# EAGLE board DRI-21700-compactpcb-12s4p-v2 (EAGLE 9.6.1)
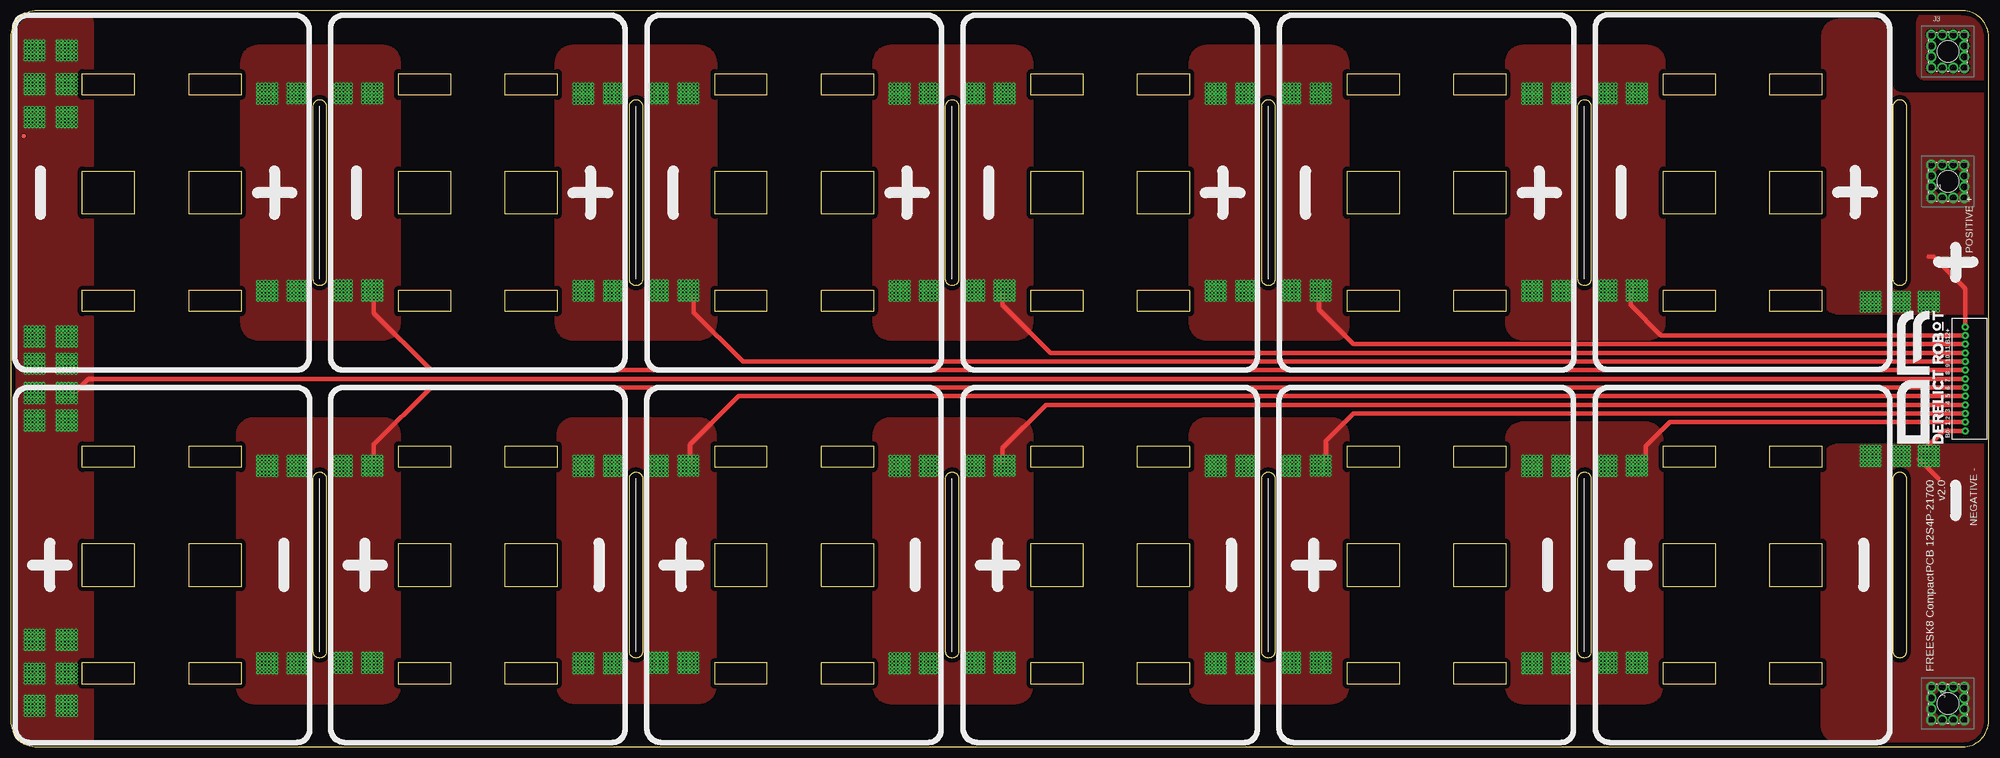
[diagram p1: board, top side]
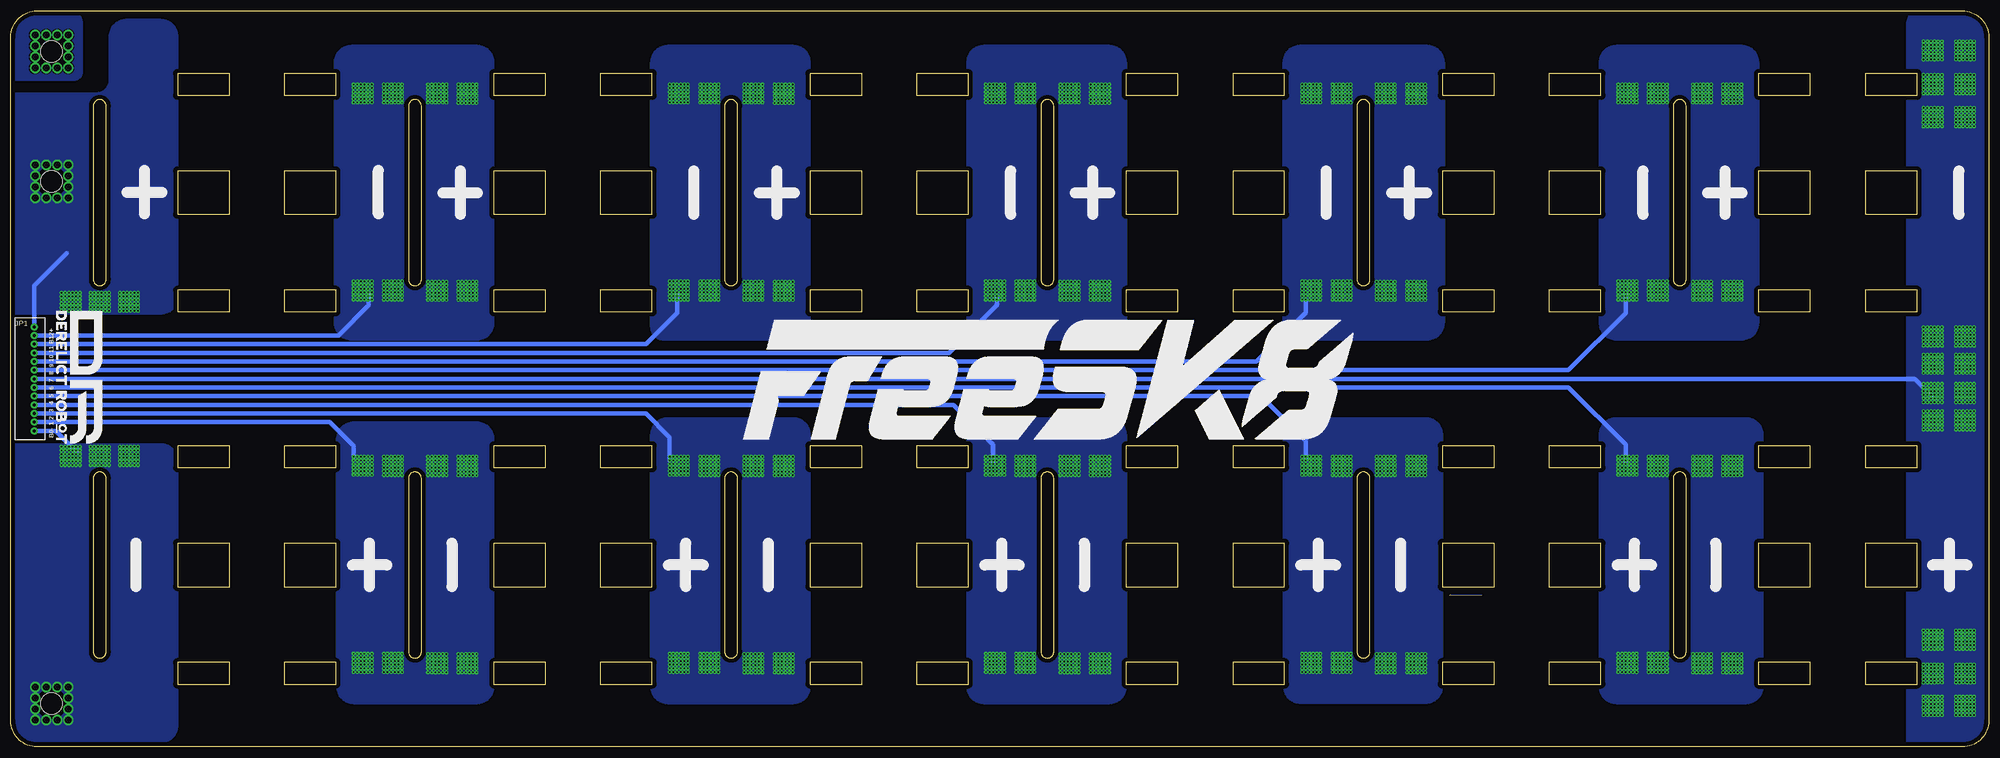
[diagram p2: board, bottom side, seen from below]

Size 456.63 x 170 mm. Coordinates in mm from the lower left corner, seen from the top.
Outline: 272.13,133 272.13,123 260.13,123 260.13,133 272.13,133
Outline: 345.13,133 345.13,123 333.13,123 333.13,133 345.13,133
Outline: 418.13,133 418.13,123 406.13,123 406.13,133 418.13,133
Outline: 381.54,37 381.54,47 393.54,47 393.54,37 381.54,37
Outline: 308.54,37 308.54,47 320.54,47 320.54,37 308.54,37
Outline: 235.53,37 235.53,47 247.53,47 247.53,37 235.53,37
Outline: 162.53,37 162.53,47 174.53,47 174.53,37 162.53,37
Outline: 174.53,133 174.53,123 162.53,123 162.53,133 174.53,133
Outline: 101.53,133 101.53,123 89.53,123 89.53,133 101.53,133
Outline: 89.53,37 89.53,47 101.53,47 101.53,37 89.53,37
Outline: 28.54,133 28.54,123 16.54,123 16.54,133 28.54,133
Outline: 16.54,37 16.54,47 28.54,47 28.54,37 16.54,37
Outline: 41.13,37 41.13,47 53.13,47 53.13,37 41.13,37
Outline: 53.13,133 53.13,123 41.13,123 41.13,133 53.13,133
Outline: 114.14,37 114.14,47 126.14,47 126.14,37 114.14,37
Outline: 126.14,133 126.14,123 114.14,123 114.14,133 126.14,133
Outline: 199.13,133 199.13,123 187.13,123 187.13,133 199.13,133
Outline: 187.13,37 187.13,47 199.13,47 199.13,37 187.13,37
Outline: 260.13,37 260.13,47 272.13,47 272.13,37 260.13,37
Outline: 333.13,37 333.13,47 345.13,47 345.13,37 333.13,37
Outline: 406.13,37 406.13,47 418.13,47 418.13,37 406.13,37
Outline: 393.54,133 393.54,123 381.54,123 381.54,133 393.54,133
Outline: 320.54,133 320.54,123 308.54,123 308.54,133 320.54,133
Outline: 247.53,133 247.53,123 235.53,123 235.53,133 247.53,133
Outline: 345.13,105.5 345.13,100.5 333.13,100.5 333.13,105.5 345.13,105.5
Outline: 320.54,105.5 320.54,100.5 308.54,100.5 308.54,105.5 320.54,105.5
Outline: 272.13,105.5 272.13,100.5 260.13,100.5 260.13,105.5 272.13,105.5
Outline: 247.53,105.5 247.53,100.5 235.53,100.5 235.53,105.5 247.53,105.5
Outline: 199.13,105.5 199.13,100.5 187.13,100.5 187.13,105.5 199.13,105.5
Outline: 174.53,105.5 174.53,100.5 162.53,100.5 162.53,105.5 174.53,105.5
Outline: 126.14,105.5 126.14,100.5 114.14,100.5 114.14,105.5 126.14,105.5
Outline: 101.53,105.5 101.53,100.5 89.53,100.5 89.53,105.5 101.53,105.5
Outline: 53.13,105.5 53.13,100.5 41.13,100.5 41.13,105.5 53.13,105.5
Outline: 28.54,105.5 28.54,100.5 16.54,100.5 16.54,105.5 28.54,105.5
Outline: 16.54,64.5 16.54,69.5 28.54,69.5 28.54,64.5 16.54,64.5
Outline: 41.13,64.5 41.13,69.5 53.13,69.5 53.13,64.5 41.13,64.5
Outline: 89.53,64.5 89.53,69.5 101.53,69.5 101.53,64.5 89.53,64.5
Outline: 114.14,64.5 114.14,69.5 126.14,69.5 126.14,64.5 114.14,64.5
Outline: 162.53,64.5 162.53,69.5 174.53,69.5 174.53,64.5 162.53,64.5
Outline: 187.13,64.5 187.13,69.5 199.13,69.5 199.13,64.5 187.13,64.5
Outline: 235.53,64.5 235.53,69.5 247.53,69.5 247.53,64.5 235.53,64.5
Outline: 260.13,64.5 260.13,69.5 272.13,69.5 272.13,64.5 260.13,64.5
Outline: 308.54,64.5 308.54,69.5 320.54,69.5 320.54,64.5 308.54,64.5
Outline: 333.13,64.5 333.13,69.5 345.13,69.5 345.13,64.5 333.13,64.5
Outline: 406.13,64.5 406.13,69.5 418.13,69.5 418.13,64.5 406.13,64.5
Outline: 381.54,64.5 381.54,69.5 393.54,69.5 393.54,64.5 381.54,64.5
Outline: 393.54,105.5 393.54,100.5 381.54,100.5 381.54,105.5 393.54,105.5
Outline: 418.13,105.5 418.13,100.5 406.13,100.5 406.13,105.5 418.13,105.5
Outline: 418.13,155.5 418.13,150.5 406.13,150.5 406.13,155.5 418.13,155.5
Outline: 393.54,155.5 393.54,150.5 381.54,150.5 381.54,155.5 393.54,155.5
Outline: 381.54,14.5 381.54,19.5 393.54,19.5 393.54,14.5 381.54,14.5
Outline: 406.13,14.5 406.13,19.5 418.13,19.5 418.13,14.5 406.13,14.5
Outline: 333.13,14.5 333.13,19.5 345.13,19.5 345.13,14.5 333.13,14.5
Outline: 308.54,14.5 308.54,19.5 320.54,19.5 320.54,14.5 308.54,14.5
Outline: 260.13,14.5 260.13,19.5 272.13,19.5 272.13,14.5 260.13,14.5
Outline: 235.53,14.5 235.53,19.5 247.53,19.5 247.53,14.5 235.53,14.5
Outline: 187.13,14.5 187.13,19.5 199.13,19.5 199.13,14.5 187.13,14.5
Outline: 162.53,14.5 162.53,19.5 174.53,19.5 174.53,14.5 162.53,14.5
Outline: 114.14,14.5 114.14,19.5 126.14,19.5 126.14,14.5 114.14,14.5
Outline: 89.53,14.5 89.53,19.5 101.53,19.5 101.53,14.5 89.53,14.5
Outline: 41.13,14.5 41.13,19.5 53.13,19.5 53.13,14.5 41.13,14.5
Outline: 16.54,14.5 16.54,19.5 28.54,19.5 28.54,14.5 16.54,14.5
Outline: 28.54,155.5 28.54,150.5 16.54,150.5 16.54,155.5 28.54,155.5
Outline: 53.13,155.5 53.13,150.5 41.13,150.5 41.13,155.5 53.13,155.5
Outline: 101.53,155.5 101.53,150.5 89.53,150.5 89.53,155.5 101.53,155.5
Outline: 126.14,155.5 126.14,150.5 114.14,150.5 114.14,155.5 126.14,155.5
Outline: 174.53,155.5 174.53,150.5 162.53,150.5 162.53,155.5 174.53,155.5
Outline: 199.13,155.5 199.13,150.5 187.13,150.5 187.13,155.5 199.13,155.5
Outline: 247.53,155.5 247.53,150.5 235.53,150.5 235.53,155.5 247.53,155.5
Outline: 272.13,155.5 272.13,150.5 260.13,150.5 260.13,155.5 272.13,155.5
Outline: 320.54,155.5 320.54,150.5 308.54,150.5 308.54,155.5 320.54,155.5
Outline: 345.13,155.5 345.13,150.5 333.13,150.5 333.13,155.5 345.13,155.5
Outline: 69.83,62 arc-180 72.83,62 72.83,22 arc-180 69.83,22 69.83,62
Outline: 218.84,22 arc-180 215.84,22 215.84,62 arc-180 218.84,62 218.84,22
Outline: 434.61,62 arc-180 437.61,62 437.61,22 arc-180 434.61,22 434.61,62
Outline: 69.83,148 arc-180 72.83,148 72.83,108 arc-180 69.83,108 69.83,148
Outline: 215.84,148 arc-180 218.84,148 218.84,108 arc-180 215.84,108 215.84,148
Outline: 361.83,148 arc-180 364.83,148 364.83,108 arc-180 361.83,108 361.83,148
Outline: 437.61,108 arc-180 434.61,108 434.61,148 arc-180 437.61,148 437.61,108
Outline: 288.83,148 arc-180 291.83,148 291.83,108 arc-180 288.83,108 288.83,148
Outline: 145.84,108 arc-180 142.84,108 142.84,148 arc-180 145.84,148 145.84,108
Outline: 364.83,22 arc-180 361.83,22 361.83,62 arc-180 364.83,62 364.83,22
Outline: 288.83,62 arc-180 291.83,62 291.83,22 arc-180 288.83,22 288.83,62
Outline: 145.84,22 arc-180 142.84,22 142.84,62 arc-180 145.84,62 145.84,22
Outline: 450.63,170 6.04,170 arc90 0,164 0,6 arc90 6.04,0 450.63,0 arc90 456.63,6 456.63,164 arc90 450.63,170
Copper layers (1*16): Top 0.035mm / dielectric 1.5mm / Bottom 0.035mm
Design rules "default": minimum track width 6mil, minimum drill 0.35mm, track to track 6mil, track to pad 6mil, pad to pad 6mil, via to via 6mil, smd to smd 6mil, copper to edge 40mil, drill to drill 6mil, minimum pad ring 10mil, minimum via ring 8mil, stop-mask expansion 4mil, vias tented up to drill 0mil, thermal gap 10mil

## Footprints (pad centres in the part's own frame; a part is rotated, then mirrored left to right if it is on the bottom)
FIDUCIAL-1X2 = smd 1 x 1: 1 0,0
7460408 = drill 1.57 pad 2.3: 1 -3.81,-3.81; 2 -1.27,-3.81; 3 1.27,-3.81; 4 3.81,-3.81; 5 3.81,-1.27; 6 3.81,1.27; 7 3.81,3.81; 8 1.27,3.81; 9 -1.27,3.81; 10 -3.81,3.81; 11 -3.81,1.27; 12 -3.81,-1.27 | hole 5: 0,0
13P-JST-2MM = drill 0.7 pad 1.6: P$1 0,-12; P$2 0,-10; P$3 0,-8; P$4 0,-6; P$5 0,-4; P$6 0,-2; P$7 0,0; P$8 0,2; P$9 0,4; P$10 0,6; P$11 0,8; P$12 0,10; P$13 0,12
TERM-PAD- = drill 0.3 pad 0.6: P$3 -1.26,0.42; P$4 -0.42,0.42; P$5 -0.42,-0.42; P$6 0.42,-0.42; P$7 0.42,0.42; P$8 -2.1,0.42; P$9 -2.1,1.26; P$10 -2.1,2.1; P$11 -1.26,2.1; P$12 -1.26,1.26; P$13 -0.42,1.26; P$14 -0.42,2.1; P$15 0.42,2.1; P$16 0.42,1.26; P$17 1.26,1.26; P$18 1.26,2.1; P$19 2.1,2.1; P$20 2.1,1.26; P$21 2.1,0.42; P$22 1.26,0.42; P$23 1.26,-0.42; P$24 2.1,-0.42; P$25 -1.26,-0.42; P$26 -2.1,-0.42; P$27 -2.1,-1.26; P$28 -2.1,-2.1; P$29 -1.26,-2.1; P$30 -0.42,-2.1; P$31 0.42,-2.1; P$32 1.26,-2.1; P$33 2.1,-2.1; P$34 2.1,-1.26; P$35 1.26,-1.26; P$36 -0.42,-1.26; P$37 0.42,-1.26; P$38 -1.26,-1.26; P$39 -0.42,7.14; P$40 0.42,7.14; P$41 -1.26,7.14; P$42 -2.1,7.14; P$43 -2.1,7.98; P$44 -2.1,8.82; P$45 -1.26,8.82; P$46 -1.26,7.98; P$47 -0.42,7.98; P$48 -0.42,8.82; P$49 0.42,8.82; P$50 0.42,7.98; P$51 1.26,7.98; P$52 1.26,8.82; P$53 2.1,8.82; P$54 2.1,7.98; P$55 2.1,7.14; P$56 1.26,7.14; P$57 -0.42,4.62; P$58 0.42,4.62; P$59 -1.26,4.62; P$60 -2.1,4.62; P$61 -2.1,5.46; P$62 -2.1,6.3; P$63 -1.26,6.3; P$64 -1.26,5.46; P$65 -0.42,5.46; P$66 -0.42,6.3; P$67 0.42,6.3; P$68 0.42,5.46; P$69 1.26,5.46; P$70 1.26,6.3; P$71 2.1,6.3; P$72 2.1,5.46; P$73 2.1,4.62; P$74 1.26,4.62; P$75 -0.42,-8.82; P$76 0.42,-8.82; P$77 -1.26,-8.82; P$78 -2.1,-8.82; P$79 -2.1,-7.98; P$80 -2.1,-7.14; P$81 -1.26,-7.14; P$82 -1.26,-7.98; P$83 -0.42,-7.98; P$84 -0.42,-7.14; P$85 0.42,-7.14; P$86 0.42,-7.98; P$87 1.26,-7.98; P$88 1.26,-7.14; P$89 2.1,-7.14; P$90 2.1,-7.98; P$91 2.1,-8.82; P$92 1.26,-8.82; P$93 -0.42,-6.3; P$94 0.42,-6.3; P$95 -1.26,-6.3; P$96 -2.1,-6.3; P$97 -2.1,-5.46; P$98 -2.1,-4.62; P$99 -1.26,-4.62; P$100 -1.26,-5.46; P$101 -0.42,-5.46; P$102 -0.42,-4.62; P$103 0.42,-4.62; P$104 0.42,-5.46; P$105 1.26,-5.46; P$106 1.26,-4.62; P$107 2.1,-4.62; P$108 2.1,-5.46; P$109 2.1,-6.3; P$110 1.26,-6.3
BAT-TERM-L = drill 0.3 pad 0.6: P$1 -12.52,20.72; P$2 -11.68,20.72; P$3 -11.68,21.56; P$4 -11.68,22.4; P$5 -5.52,23.32; P$6 -4.68,23.32; P$7 -4.68,22.48; P$8 -5.52,22.48; P$9 -5.52,21.64; P$10 -5.52,20.8; P$11 -6.36,20.8; P$12 -7.2,20.8; P$13 -4.68,24.16; P$14 -4.68,25; P$15 -3.84,25; P$16 -3,25; P$17 -3.84,23.32; P$18 -3,23.32; P$19 -3,24.16; P$20 -3.84,24.16; P$21 -3.84,21.64; P$22 -3.84,22.48; P$23 -3,22.48; P$24 -3,21.64; P$25 -3,20.8; P$26 -3.84,20.8; P$27 -4.68,20.8; P$28 -4.68,21.64; P$29 -6.36,21.64; P$30 -7.2,21.64; P$31 -7.2,22.48; P$32 -6.36,22.48; P$33 -6.36,23.32; P$34 -7.2,23.32; P$35 -7.2,24.16; P$36 -6.36,24.16; P$37 -6.36,25; P$38 -7.2,25; P$39 -5.52,24.16; P$40 -5.52,25; P$41 -12.52,-22.28; P$42 4.68,23.32; P$43 5.52,23.32; P$44 5.52,22.48; P$45 4.68,22.48; P$46 4.68,21.64; P$47 4.68,20.8; P$48 3.84,20.8; P$49 3,20.8; P$50 5.52,24.16; P$51 5.52,25; P$52 6.36,25; P$53 7.2,25; P$54 6.36,23.32; P$55 7.2,23.32; P$56 7.2,24.16; P$57 6.36,24.16; P$58 6.36,21.64; P$59 6.36,22.48; P$60 7.2,22.48; P$61 7.2,21.64; P$62 7.2,20.8; P$63 6.36,20.8; P$64 5.52,20.8; P$65 5.52,21.64; P$66 3.84,21.64; P$67 3,21.64; P$68 3,22.48; P$69 3.84,22.48; P$70 3.84,23.32; P$71 3,23.32; P$72 3,24.16; P$73 3.84,24.16; P$74 3.84,25; P$75 3,25; P$76 4.68,24.16; P$77 4.68,25; P$78 -11.68,-22.28; P$79 -11.68,-23.12; P$80 -12.52,-23.12; P$81 -12.52,-23.96; P$82 -12.52,-24.8; P$83 -13.36,-24.8; P$84 -14.2,-24.8; P$85 -11.68,-21.44; P$86 -11.68,-20.6; P$87 -10.84,-20.6; P$88 -10,-20.6; P$89 -10.84,-22.28; P$90 -10,-22.28; P$91 -10,-21.44; P$92 -10.84,-21.44; P$93 -10.84,-23.96; P$94 -10.84,-23.12; P$95 -10,-23.12; P$96 -10,-23.96; P$97 -10,-24.8; P$98 -10.84,-24.8; P$99 -11.68,-24.8; P$100 -11.68,-23.96; P$101 -13.36,-23.96; P$102 -14.2,-23.96; P$103 -14.2,-23.12; P$104 -13.36,-23.12; P$105 -13.36,-22.28; P$106 -14.2,-22.28; P$107 -14.2,-21.44; P$108 -13.36,-21.44; P$109 -13.36,-20.6; P$110 -14.2,-20.6; P$111 -12.52,-21.44; P$112 -12.52,-20.6; P$113 -10.84,22.4; P$114 -5.52,-22.28; P$115 -4.68,-22.28; P$116 -4.68,-23.12; P$117 -5.52,-23.12; P$118 -5.52,-23.96; P$119 -5.52,-24.8; P$120 -6.36,-24.8; P$121 -7.2,-24.8; P$122 -4.68,-21.44; P$123 -4.68,-20.6; P$124 -3.84,-20.6; P$125 -3,-20.6; P$126 -3.84,-22.28; P$127 -3,-22.28; P$128 -3,-21.44; P$129 -3.84,-21.44; P$130 -3.84,-23.96; P$131 -3.84,-23.12; P$132 -3,-23.12; P$133 -3,-23.96; P$134 -3,-24.8; P$135 -3.84,-24.8; P$136 -4.68,-24.8; P$137 -4.68,-23.96; P$138 -6.36,-23.96; P$139 -7.2,-23.96; P$140 -7.2,-23.12; P$141 -6.36,-23.12; P$142 -6.36,-22.28; P$143 -7.2,-22.28; P$144 -7.2,-21.44; P$145 -6.36,-21.44; P$146 -6.36,-20.6; P$147 -7.2,-20.6; P$148 -5.52,-21.44; P$149 -5.52,-20.6; P$150 -10,22.4; P$151 4.68,-22.18; P$152 5.52,-22.18; P$153 5.52,-23.02; P$154 4.68,-23.02; P$155 4.68,-23.86; P$156 4.68,-24.7; P$157 3.84,-24.7; P$158 3,-24.7; P$159 5.52,-21.34; P$160 5.52,-20.5; P$161 6.36,-20.5; P$162 7.2,-20.5; P$163 6.36,-22.18; P$164 7.2,-22.18; P$165 7.2,-21.34; P$166 6.36,-21.34; P$167 6.36,-23.86; P$168 6.36,-23.02; P$169 7.2,-23.02; P$170 7.2,-23.86; P$171 7.2,-24.7; P$172 6.36,-24.7; P$173 5.52,-24.7; P$174 5.52,-23.86; P$175 3.84,-23.86; P$176 3,-23.86; P$177 3,-23.02; P$178 3.84,-23.02; P$179 3.84,-22.18; P$180 3,-22.18; P$181 3,-21.34; P$182 3.84,-21.34; P$183 3.84,-20.5; P$184 3,-20.5; P$185 4.68,-21.34; P$186 4.68,-20.5; P$187 -10.84,20.72; P$188 11.68,-22.18; P$189 12.52,-22.18; P$190 12.52,-23.02; P$191 11.68,-23.02; P$192 11.68,-23.86; P$193 11.68,-24.7; P$194 10.84,-24.7; P$195 10,-24.7; P$196 12.52,-21.34; P$197 12.52,-20.5; P$198 13.36,-20.5; P$199 14.2,-20.5; P$200 13.36,-22.18; P$201 14.2,-22.18; P$202 14.2,-21.34; P$203 13.36,-21.34; P$204 13.36,-23.86; P$205 13.36,-23.02; P$206 14.2,-23.02; P$207 14.2,-23.86; P$208 14.2,-24.7; P$209 13.36,-24.7; P$210 12.52,-24.7; P$211 12.52,-23.86; P$212 10.84,-23.86; P$213 10,-23.86; P$214 10,-23.02; P$215 10.84,-23.02; P$216 10.84,-22.18; P$217 10,-22.18; P$218 10,-21.34; P$219 10.84,-21.34; P$220 10.84,-20.5; P$221 10,-20.5; P$222 11.68,-21.34; P$223 11.68,-20.5; P$224 -10,20.72; P$225 -10,21.56; P$226 -10.84,21.56; P$227 -13.36,20.72; P$228 -14.2,20.72; P$229 -14.2,21.56; P$230 -13.36,21.56; P$231 -13.36,22.4; P$232 -14.2,22.4; P$233 -12.52,21.56; P$234 -12.52,22.4; P$235 11.68,20.82; P$236 12.52,20.82; P$237 12.52,21.66; P$238 12.52,22.5; P$239 13.36,22.5; P$240 14.2,22.5; P$241 13.36,20.82; P$242 14.2,20.82; P$243 14.2,21.66; P$244 13.36,21.66; P$245 10.84,20.82; P$246 10,20.82; P$247 10,21.66; P$248 10.84,21.66; P$249 10.84,22.5; P$250 10,22.5; P$251 11.68,21.66; P$252 11.68,22.5; P$253 -12.52,23.32; P$254 -11.68,23.32; P$255 -11.68,24.16; P$256 -11.68,25; P$257 -10.84,25; P$258 -10,25; P$259 -10.84,23.32; P$260 -10,23.32; P$261 -10,24.16; P$262 -10.84,24.16; P$263 -13.36,23.32; P$264 -14.2,23.32; P$265 -14.2,24.16; P$266 -13.36,24.16; P$267 -13.36,25; P$268 -14.2,25; P$269 -12.52,24.16; P$270 -12.52,25; P$271 11.68,23.32; P$272 12.52,23.32; P$273 12.52,24.16; P$274 12.52,25; P$275 13.36,25; P$276 14.2,25; P$277 13.36,23.32; P$278 14.2,23.32; P$279 14.2,24.16; P$280 13.36,24.16; P$281 10.84,23.32; P$282 10,23.32; P$283 10,24.16; P$284 10.84,24.16; P$285 10.84,25; P$286 10,25; P$287 11.68,24.16; P$288 11.68,25
BAT-TERM-END = drill 0.3 pad 0.6: P$1 -4.167,-2.852; P$2 -4.167,-59.842; P$3 -4.167,-60.682; P$4 -3.327,-60.682; P$5 -3.327,-59.842; P$6 -4.167,-59.002; P$7 -4.167,-58.162; P$8 -5.007,-58.162; P$9 -5.847,-58.162; P$10 -5.847,-59.002; P$11 -5.847,-59.842; P$12 -5.847,-60.682; P$13 -5.847,-61.522; P$14 -5.847,-62.362; P$15 -5.007,-62.362; P$16 -4.167,-62.362; P$17 -2.487,-62.362; P$18 -3.327,-62.362; P$19 -1.647,-62.362; P$20 -1.647,-61.522; P$21 -1.647,-60.682; P$22 -1.647,-59.842; P$23 -1.647,-59.002; P$24 -1.647,-58.162; P$25 -2.487,-58.162; P$26 -3.327,-58.162; P$27 -3.327,-59.002; P$28 -2.487,-59.002; P$29 -2.487,-59.842; P$30 -2.487,-60.682; P$31 -2.487,-61.522; P$32 -3.327,-61.522; P$33 -4.167,-61.522; P$34 -5.007,-61.522; P$35 -5.007,-60.682; P$36 -5.007,-59.842; P$37 -5.007,-59.002; P$38 -4.167,-3.692; P$39 3.293,-59.842; P$40 3.293,-60.682; P$41 4.133,-60.682; P$42 4.133,-59.842; P$43 3.293,-59.002; P$44 3.293,-58.162; P$45 2.453,-58.162; P$46 1.613,-58.162; P$47 1.613,-59.002; P$48 1.613,-59.842; P$49 1.613,-60.682; P$50 1.613,-61.522; P$51 1.613,-62.362; P$52 2.453,-62.362; P$53 3.293,-62.362; P$54 4.973,-62.362; P$55 4.133,-62.362; P$56 5.813,-62.362; P$57 5.813,-61.522; P$58 5.813,-60.682; P$59 5.813,-59.842; P$60 5.813,-59.002; P$61 5.813,-58.162; P$62 4.973,-58.162; P$63 4.133,-58.162; P$64 4.133,-59.002; P$65 4.973,-59.002; P$66 4.973,-59.842; P$67 4.973,-60.682; P$68 4.973,-61.522; P$69 4.133,-61.522; P$70 3.293,-61.522; P$71 2.453,-61.522; P$72 2.453,-60.682; P$73 2.453,-59.842; P$74 2.453,-59.002; P$75 -3.327,-3.692; P$76 -4.167,-75.102; P$77 -4.167,-75.942; P$78 -3.327,-75.942; P$79 -3.327,-75.102; P$80 -4.167,-74.262; P$81 -4.167,-73.422; P$82 -5.007,-73.422; P$83 -5.847,-73.422; P$84 -5.847,-74.262; P$85 -5.847,-75.102; P$86 -5.847,-75.942; P$87 -5.847,-76.782; P$88 -5.847,-77.622; P$89 -5.007,-77.622; P$90 -4.167,-77.622; P$91 -2.487,-77.622; P$92 -3.327,-77.622; P$93 -1.647,-77.622; P$94 -1.647,-76.782; P$95 -1.647,-75.942; P$96 -1.647,-75.102; P$97 -1.647,-74.262; P$98 -1.647,-73.422; P$99 -2.487,-73.422; P$100 -3.327,-73.422; P$101 -3.327,-74.262; P$102 -2.487,-74.262; P$103 -2.487,-75.102; P$104 -2.487,-75.942; P$105 -2.487,-76.782; P$106 -3.327,-76.782; P$107 -4.167,-76.782; P$108 -5.007,-76.782; P$109 -5.007,-75.942; P$110 -5.007,-75.102; P$111 -5.007,-74.262; P$112 -3.327,-2.852; P$113 3.293,-75.102; P$114 3.293,-75.942; P$115 4.133,-75.942; P$116 4.133,-75.102; P$117 3.293,-74.262; P$118 3.293,-73.422; P$119 2.453,-73.422; P$120 1.613,-73.422; P$121 1.613,-74.262; P$122 1.613,-75.102; P$123 1.613,-75.942; P$124 1.613,-76.782; P$125 1.613,-77.622; P$126 2.453,-77.622; P$127 3.293,-77.622; P$128 4.973,-77.622; P$129 4.133,-77.622; P$130 5.813,-77.622; P$131 5.813,-76.782; P$132 5.813,-75.942; P$133 5.813,-75.102; P$134 5.813,-74.262; P$135 5.813,-73.422; P$136 4.973,-73.422; P$137 4.133,-73.422; P$138 4.133,-74.262; P$139 4.973,-74.262; P$140 4.973,-75.102; P$141 4.973,-75.942; P$142 4.973,-76.782; P$143 4.133,-76.782; P$144 3.293,-76.782; P$145 2.453,-76.782; P$146 2.453,-75.942; P$147 2.453,-75.102; P$148 2.453,-74.262; P$149 -4.167,-2.012; P$150 4.133,67.638; P$151 4.133,68.478; P$152 3.293,68.478; P$153 3.293,67.638; P$154 4.133,66.798; P$155 4.133,65.958; P$156 4.973,65.958; P$157 5.813,65.958; P$158 5.813,66.798; P$159 5.813,67.638; P$160 5.813,68.478; P$161 5.813,69.318; P$162 5.813,70.158; P$163 4.973,70.158; P$164 4.133,70.158; P$165 2.453,70.158; P$166 3.293,70.158; P$167 1.613,70.158; P$168 1.613,69.318; P$169 1.613,68.478; P$170 1.613,67.638; P$171 1.613,66.798; P$172 1.613,65.958; P$173 2.453,65.958; P$174 3.293,65.958; P$175 3.293,66.798; P$176 2.453,66.798; P$177 2.453,67.638; P$178 2.453,68.478; P$179 2.453,69.318; P$180 3.293,69.318; P$181 4.133,69.318; P$182 4.973,69.318; P$183 4.973,68.478; P$184 4.973,67.638; P$185 4.973,66.798; P$186 -4.167,-1.172; P$187 -3.327,67.638; P$188 -3.327,68.478; P$189 -4.167,68.478; P$190 -4.167,67.638; P$191 -3.327,66.798; P$192 -3.327,65.958; P$193 -2.487,65.958; P$194 -1.647,65.958; P$195 -1.647,66.798; P$196 -1.647,67.638; P$197 -1.647,68.478; P$198 -1.647,69.318; P$199 -1.647,70.158; P$200 -2.487,70.158; P$201 -3.327,70.158; P$202 -5.007,70.158; P$203 -4.167,70.158; P$204 -5.847,70.158; P$205 -5.847,69.318; P$206 -5.847,68.478; P$207 -5.847,67.638; P$208 -5.847,66.798; P$209 -5.847,65.958; P$210 -5.007,65.958; P$211 -4.167,65.958; P$212 -4.167,66.798; P$213 -5.007,66.798; P$214 -5.007,67.638; P$215 -5.007,68.478; P$216 -5.007,69.318; P$217 -4.167,69.318; P$218 -3.327,69.318; P$219 -2.487,69.318; P$220 -2.487,68.478; P$221 -2.487,67.638; P$222 -2.487,66.798; P$223 -5.007,-1.172; P$224 4.133,60.038; P$225 4.133,60.878; P$226 3.293,60.878; P$227 3.293,60.038; P$228 4.133,59.198; P$229 4.133,58.358; P$230 4.973,58.358; P$231 5.813,58.358; P$232 5.813,59.198; P$233 5.813,60.038; P$234 5.813,60.878; P$235 5.813,61.718; P$236 5.813,62.558; P$237 4.973,62.558; P$238 4.133,62.558; P$239 2.453,62.558; P$240 3.293,62.558; P$241 1.613,62.558; P$242 1.613,61.718; P$243 1.613,60.878; P$244 1.613,60.038; P$245 1.613,59.198; P$246 1.613,58.358; P$247 2.453,58.358; P$248 3.293,58.358; P$249 3.293,59.198; P$250 2.453,59.198; P$251 2.453,60.038; P$252 2.453,60.878; P$253 2.453,61.718; P$254 3.293,61.718; P$255 4.133,61.718; P$256 4.973,61.718; P$257 4.973,60.878; P$258 4.973,60.038; P$259 4.973,59.198; P$260 -5.847,-1.172; P$261 -3.327,60.038; P$262 -3.327,60.878; P$263 -4.167,60.878; P$264 -4.167,60.038; P$265 -3.327,59.198; P$266 -3.327,58.358; P$267 -2.487,58.358; P$268 -1.647,58.358; P$269 -1.647,59.198; P$270 -1.647,60.038; P$271 -1.647,60.878; P$272 -1.647,61.718; P$273 -1.647,62.558; P$274 -2.487,62.558; P$275 -3.327,62.558; P$276 -5.007,62.558; P$277 -4.167,62.558; P$278 -5.847,62.558; P$279 -5.847,61.718; P$280 -5.847,60.878; P$281 -5.847,60.038; P$282 -5.847,59.198; P$283 -5.847,58.358; P$284 -5.007,58.358; P$285 -4.167,58.358; P$286 -4.167,59.198; P$287 -5.007,59.198; P$288 -5.007,60.038; P$289 -5.007,60.878; P$290 -5.007,61.718; P$291 -4.167,61.718; P$292 -3.327,61.718; P$293 -2.487,61.718; P$294 -2.487,60.878; P$295 -2.487,60.038; P$296 -2.487,59.198; P$297 -5.847,-2.012; P$298 -5.847,-2.852; P$299 -5.847,-3.692; P$300 -5.847,-4.532; P$301 -5.847,-5.372; P$302 -5.007,-5.372; P$303 -4.167,-5.372; P$304 -2.487,-5.372; P$305 -3.327,-5.372; P$306 -1.647,-5.372; P$307 -1.647,-4.532; P$308 -1.647,-3.692; P$309 -1.647,-2.852; P$310 -1.647,-2.012; P$311 -1.647,-1.172; P$312 -2.487,-1.172; P$313 -3.327,-1.172; P$314 -3.327,-2.012; P$315 -2.487,-2.012; P$316 -2.487,-2.852; P$317 -2.487,-3.692; P$318 -2.487,-4.532; P$319 -3.327,-4.532; P$320 -4.167,-4.532; P$321 -5.007,-4.532; P$322 -5.007,-3.692; P$323 -5.007,-2.852; P$324 -5.007,-2.012; P$325 3.293,-2.852; P$326 3.293,-3.692; P$327 4.133,-3.692; P$328 4.133,-2.852; P$329 3.293,-2.012; P$330 3.293,-1.172; P$331 2.453,-1.172; P$332 1.613,-1.172; P$333 1.613,-2.012; P$334 1.613,-2.852; P$335 1.613,-3.692; P$336 1.613,-4.532; P$337 1.613,-5.372; P$338 2.453,-5.372; P$339 3.293,-5.372; P$340 4.973,-5.372; P$341 4.133,-5.372; P$342 5.813,-5.372; P$343 5.813,-4.532; P$344 5.813,-3.692; P$345 5.813,-2.852; P$346 5.813,-2.012; P$347 5.813,-1.172; P$348 4.973,-1.172; P$349 4.133,-1.172; P$350 4.133,-2.012; P$351 4.973,-2.012; P$352 4.973,-2.852; P$353 4.973,-3.692; P$354 4.973,-4.532; P$355 4.133,-4.532; P$356 3.293,-4.532; P$357 2.453,-4.532; P$358 2.453,-3.692; P$359 2.453,-2.852; P$360 2.453,-2.012; P$361 -4.167,-67.642; P$362 -4.167,-68.482; P$363 -3.327,-68.482; P$364 -3.327,-67.642; P$365 -4.167,-66.802; P$366 -4.167,-65.962; P$367 -5.007,-65.962; P$368 -5.847,-65.962; P$369 -5.847,-66.802; P$370 -5.847,-67.642; P$371 -5.847,-68.482; P$372 -5.847,-69.322; P$373 -5.847,-70.162; P$374 -5.007,-70.162; P$375 -4.167,-70.162; P$376 -2.487,-70.162; P$377 -3.327,-70.162; P$378 -1.647,-70.162; P$379 -1.647,-69.322; P$380 -1.647,-68.482; P$381 -1.647,-67.642; P$382 -1.647,-66.802; P$383 -1.647,-65.962; P$384 -2.487,-65.962; P$385 -3.327,-65.962; P$386 -3.327,-66.802; P$387 -2.487,-66.802; P$388 -2.487,-67.642; P$389 -2.487,-68.482; P$390 -2.487,-69.322; P$391 -3.327,-69.322; P$392 -4.167,-69.322; P$393 -5.007,-69.322; P$394 -5.007,-68.482; P$395 -5.007,-67.642; P$396 -5.007,-66.802; P$397 3.293,-67.642; P$398 3.293,-68.482; P$399 4.133,-68.482; P$400 4.133,-67.642; P$401 3.293,-66.802; P$402 3.293,-65.962; P$403 2.453,-65.962; P$404 1.613,-65.962; P$405 1.613,-66.802; P$406 1.613,-67.642; P$407 1.613,-68.482; P$408 1.613,-69.322; P$409 1.613,-70.162; P$410 2.453,-70.162; P$411 3.293,-70.162; P$412 4.973,-70.162; P$413 4.133,-70.162; P$414 5.813,-70.162; P$415 5.813,-69.322; P$416 5.813,-68.482; P$417 5.813,-67.642; P$418 5.813,-66.802; P$419 5.813,-65.962; P$420 4.973,-65.962; P$421 4.133,-65.962; P$422 4.133,-66.802; P$423 4.973,-66.802; P$424 4.973,-67.642; P$425 4.973,-68.482; P$426 4.973,-69.322; P$427 4.133,-69.322; P$428 3.293,-69.322; P$429 2.453,-69.322; P$430 2.453,-68.482; P$431 2.453,-67.642; P$432 2.453,-66.802; P$433 4.133,9.368; P$434 4.133,10.208; P$435 3.293,10.208; P$436 3.293,9.368; P$437 4.133,8.528; P$438 4.133,7.688; P$439 4.973,7.688; P$440 5.813,7.688; P$441 5.813,8.528; P$442 5.813,9.368; P$443 5.813,10.208; P$444 5.813,11.048; P$445 5.813,11.888; P$446 4.973,11.888; P$447 4.133,11.888; P$448 2.453,11.888; P$449 3.293,11.888; P$450 1.613,11.888; P$451 1.613,11.048; P$452 1.613,10.208; P$453 1.613,9.368; P$454 1.613,8.528; P$455 1.613,7.688; P$456 2.453,7.688; P$457 3.293,7.688; P$458 3.293,8.528; P$459 2.453,8.528; P$460 2.453,9.368; P$461 2.453,10.208; P$462 2.453,11.048; P$463 3.293,11.048; P$464 4.133,11.048; P$465 4.973,11.048; P$466 4.973,10.208; P$467 4.973,9.368; P$468 4.973,8.528; P$469 -3.327,9.368; P$470 -3.327,10.208; P$471 -4.167,10.208; P$472 -4.167,9.368; P$473 -3.327,8.528; P$474 -3.327,7.688; P$475 -2.487,7.688; P$476 -1.647,7.688; P$477 -1.647,8.528; P$478 -1.647,9.368; P$479 -1.647,10.208; P$480 -1.647,11.048; P$481 -1.647,11.888; P$482 -2.487,11.888; P$483 -3.327,11.888; P$484 -5.007,11.888; P$485 -4.167,11.888; P$486 -5.847,11.888; P$487 -5.847,11.048; P$488 -5.847,10.208; P$489 -5.847,9.368; P$490 -5.847,8.528; P$491 -5.847,7.688; P$492 -5.007,7.688; P$493 -4.167,7.688; P$494 -4.167,8.528; P$495 -5.007,8.528; P$496 -5.007,9.368; P$497 -5.007,10.208; P$498 -5.007,11.048; P$499 -4.167,11.048; P$500 -3.327,11.048; P$501 -2.487,11.048; P$502 -2.487,10.208; P$503 -2.487,9.368; P$504 -2.487,8.528; P$505 -4.167,-9.192; P$506 -4.167,-10.032; P$507 -3.327,-10.032; P$508 -3.327,-9.192; P$509 -4.167,-8.352; P$510 -4.167,-7.512; P$511 -5.007,-7.512; P$512 -5.847,-7.512; P$513 -5.847,-8.352; P$514 -5.847,-9.192; P$515 -5.847,-10.032; P$516 -5.847,-10.872; P$517 -5.847,-11.712; P$518 -5.007,-11.712; P$519 -4.167,-11.712; P$520 -2.487,-11.712; P$521 -3.327,-11.712; P$522 -1.647,-11.712; P$523 -1.647,-10.872; P$524 -1.647,-10.032; P$525 -1.647,-9.192; P$526 -1.647,-8.352; P$527 -1.647,-7.512; P$528 -2.487,-7.512; P$529 -3.327,-7.512; P$530 -3.327,-8.352; P$531 -2.487,-8.352; P$532 -2.487,-9.192; P$533 -2.487,-10.032; P$534 -2.487,-10.872; P$535 -3.327,-10.872; P$536 -4.167,-10.872; P$537 -5.007,-10.872; P$538 -5.007,-10.032; P$539 -5.007,-9.192; P$540 -5.007,-8.352; P$541 3.293,-9.192; P$542 3.293,-10.032; P$543 4.133,-10.032; P$544 4.133,-9.192; P$545 3.293,-8.352; P$546 3.293,-7.512; P$547 2.453,-7.512; P$548 1.613,-7.512; P$549 1.613,-8.352; P$550 1.613,-9.192; P$551 1.613,-10.032; P$552 1.613,-10.872; P$553 1.613,-11.712; P$554 2.453,-11.712; P$555 3.293,-11.712; P$556 4.973,-11.712; P$557 4.133,-11.712; P$558 5.813,-11.712; P$559 5.813,-10.872; P$560 5.813,-10.032; P$561 5.813,-9.192; P$562 5.813,-8.352; P$563 5.813,-7.512; P$564 4.973,-7.512; P$565 4.133,-7.512; P$566 4.133,-8.352; P$567 4.973,-8.352; P$568 4.973,-9.192; P$569 4.973,-10.032; P$570 4.973,-10.872; P$571 4.133,-10.872; P$572 3.293,-10.872; P$573 2.453,-10.872; P$574 2.453,-10.032; P$575 2.453,-9.192; P$576 2.453,-8.352; P$577 4.133,3.028; P$578 4.133,3.868; P$579 3.293,3.868; P$580 3.293,3.028; P$581 4.133,2.188; P$582 4.133,1.348; P$583 4.973,1.348; P$584 5.813,1.348; P$585 5.813,2.188; P$586 5.813,3.028; P$587 5.813,3.868; P$588 5.813,4.708; P$589 5.813,5.548; P$590 4.973,5.548; P$591 4.133,5.548; P$592 2.453,5.548; P$593 3.293,5.548; P$594 1.613,5.548; P$595 1.613,4.708; P$596 1.613,3.868; P$597 1.613,3.028; P$598 1.613,2.188; P$599 1.613,1.348; P$600 2.453,1.348; P$601 3.293,1.348; P$602 3.293,2.188; P$603 2.453,2.188; P$604 2.453,3.028; P$605 2.453,3.868; P$606 2.453,4.708; P$607 3.293,4.708; P$608 4.133,4.708; P$609 4.973,4.708; P$610 4.973,3.868; P$611 4.973,3.028; P$612 4.973,2.188; P$613 -3.327,3.028; P$614 -3.327,3.868; P$615 -4.167,3.868; P$616 -4.167,3.028; P$617 -3.327,2.188; P$618 -3.327,1.348; P$619 -2.487,1.348; P$620 -1.647,1.348; P$621 -1.647,2.188; P$622 -1.647,3.028; P$623 -1.647,3.868; P$624 -1.647,4.708; P$625 -1.647,5.548; P$626 -2.487,5.548; P$627 -3.327,5.548; P$628 -5.007,5.548; P$629 -4.167,5.548; P$630 -5.847,5.548; P$631 -5.847,4.708; P$632 -5.847,3.868; P$633 -5.847,3.028; P$634 -5.847,2.188; P$635 -5.847,1.348; P$636 -5.007,1.348; P$637 -4.167,1.348; P$638 -4.167,2.188; P$639 -5.007,2.188; P$640 -5.007,3.028; P$641 -5.007,3.868; P$642 -5.007,4.708; P$643 -4.167,4.708; P$644 -3.327,4.708; P$645 -2.487,4.708; P$646 -2.487,3.868; P$647 -2.487,3.028; P$648 -2.487,2.188; P$649 4.133,75.438; P$650 4.133,76.278; P$651 3.293,76.278; P$652 3.293,75.438; P$653 4.133,74.598; P$654 4.133,73.758; P$655 4.973,73.758; P$656 5.813,73.758; P$657 5.813,74.598; P$658 5.813,75.438; P$659 5.813,76.278; P$660 5.813,77.118; P$661 5.813,77.958; P$662 4.973,77.958; P$663 4.133,77.958; P$664 2.453,77.958; P$665 3.293,77.958; P$666 1.613,77.958; P$667 1.613,77.118; P$668 1.613,76.278; P$669 1.613,75.438; P$670 1.613,74.598; P$671 1.613,73.758; P$672 2.453,73.758; P$673 3.293,73.758; P$674 3.293,74.598; P$675 2.453,74.598; P$676 2.453,75.438; P$677 2.453,76.278; P$678 2.453,77.118; P$679 3.293,77.118; P$680 4.133,77.118; P$681 4.973,77.118; P$682 4.973,76.278; P$683 4.973,75.438; P$684 4.973,74.598; P$685 -3.327,75.438; P$686 -3.327,76.278; P$687 -4.167,76.278; P$688 -4.167,75.438; P$689 -3.327,74.598; P$690 -3.327,73.758; P$691 -2.487,73.758; P$692 -1.647,73.758; P$693 -1.647,74.598; P$694 -1.647,75.438; P$695 -1.647,76.278; P$696 -1.647,77.118; P$697 -1.647,77.958; P$698 -2.487,77.958; P$699 -3.327,77.958; P$700 -5.007,77.958; P$701 -4.167,77.958; P$702 -5.847,77.958; P$703 -5.847,77.118; P$704 -5.847,76.278; P$705 -5.847,75.438; P$706 -5.847,74.598; P$707 -5.847,73.758; P$708 -5.007,73.758; P$709 -4.167,73.758; P$710 -4.167,74.598; P$711 -5.007,74.598; P$712 -5.007,75.438; P$713 -5.007,76.278; P$714 -5.007,77.118; P$715 -4.167,77.118; P$716 -3.327,77.118; P$717 -2.487,77.118; P$718 -2.487,76.278; P$719 -2.487,75.438; P$720 -2.487,74.598

## Placement (x,y rotation side)
FD2  FIDUCIAL1X2  [FIDUCIAL-1X2]  3.01,141.05 0 top
J1  7460408  [7460408]  447.2,130.6 0 top
J2  7460408  [7460408]  447.2,10 270 top
J3  7460408  [7460408]  447.2,160.6 0 top
JP1  13P-JST-2MM  [13P-JST-2MM]  451.2,85 0 bottom
P0  BUS-TERM-PAD-  [TERM-PAD-]  436.1,67.2 270 top
P1  BAT-TERM-L  [BAT-TERM-L]  363.3,42 0 top
P2  BAT-TERM-L  [BAT-TERM-L]  290.3,42 0 top
P3  BAT-TERM-L  [BAT-TERM-L]  217.3,42 0 top
P4  BAT-TERM-L  [BAT-TERM-L]  144.3,42 0 top
P5  BAT-TERM-L  [BAT-TERM-L]  71.3,42 0 top
P6  BAT-TERM-END  [BAT-TERM-END]  9.2,85 0 top
P7  BAT-TERM-L  [BAT-TERM-L]  71.3,128 0 top
P8  BAT-TERM-L  [BAT-TERM-L]  144.3,128 0 top
P9  BAT-TERM-L  [BAT-TERM-L]  217.3,128 0 top
P10  BAT-TERM-L  [BAT-TERM-L]  290.3,128 0 top
P11  BAT-TERM-L  [BAT-TERM-L]  363.3,128 0 top
P12  BUS-TERM-PAD+  [TERM-PAD-]  436.1,102.8 90 top
U$1  [4PBATTERY]  399.8,128.1 270 top
U$2  [4PBATTERY]  326.9,128 270 top
U$3  [4PBATTERY]  253.8,42 90 top
U$4  [4PBATTERY]  180.8,42 90 top
U$5  [4PBATTERY]  107.8,42 90 top
U$6  [4PBATTERY]  35,42 90 top
U$7  [4PBATTERY]  399.8,42 90 top
U$8  [4PBATTERY]  326.8,42 90 top
U$9  [4PBATTERY]  253.8,128 270 top
U$10  [4PBATTERY]  180.9,128 270 top
U$11  [4PBATTERY]  107.8,128 270 top
U$12  [4PBATTERY]  34.9,128 270 top

## Tracks (layer width: path | path; a pad name or v marks a point on that pad's centre or on a via)
OUTPUT+
  pour Top: 443,170 460,170 460,154 442,154 arc-90 440,156 440,167 arc-90
  pour Bottom: 440,156 440,167 arc-90 443,170 460,170 460,154 442,154 arc-90
P0-
  Top 1: 445,62 440.5,66.5 | JP1.P$1 446.1,73 P0.P$64
  Bottom 1: JP1.P$1 446.26,73 441.72,68.46 P0.P$59
  Bottom 1.27: JP1.P$1 451.1,72.9
  pour Top (no thermals): 462,66 462,2 arc-90 461,1 422,1 arc-90 418,5 418,66 arc-90 422,70 458,70 arc-90
  pour Bottom (no thermals): 422,70 458,70 arc-90 462,66 462,2 arc-90 461,1 422,1 arc-90 418,5 418,66 arc-90
P1
  Top 1: JP1.P$2 383,75 377.5,69.5 P1.P$279
  Bottom 1: JP1.P$2 383,75 377.5,69.5 P1.P$276
  pour Bottom: 377.5,10 349,10 arc-90 345,14 345,71 arc-90 349,75 377.5,75 arc-90 381.5,71 381.5,14 arc-90
  pour Top: 345,71 345,14 arc90 349,10 377.5,10 arc90 381.5,14 381.5,71 arc90 377.5,75 349,75 arc90
P2
  Top 1: JP1.P$3 310,77 303.66,70.66 P2.P$280
  Bottom 1: JP1.P$3 310,77 304.5,71.5 P2.P$279
  pour Top: 272,72 272,14 arc90 276,10 305,10 arc90 309,14 309,72 arc90 305,76 276,76 arc90
  pour Bottom: 305,10 276,10 arc-90 272,14 272,72 arc-90 276,76 305,76 arc-90 309,72 309,14 arc-90
P3
  Top 1: JP1.P$4 239,79 228.98,68.98 P3.P$271
  Bottom 1: JP1.P$4 239,79 229.82,69.82 P3.P$272
  pour Top: 199,72 199,14 arc90 203,10 232,10 arc90 236,14 236,72 arc90 232,76 203,76 arc90
  pour Bottom: 203,76 232,76 arc-90 236,72 236,14 arc-90 232,10 203,10 arc-90 199,14 199,72 arc-90
P4
  Top 1: JP1.P$5 168,81 156.82,69.82 P4.P$273
  Bottom 1: JP1.P$5 168,81 157.66,70.66 P4.P$280
  pour Top: 126,72 126,14.06 arc90 130,10.06 158.9,10.06 arc90 162.9,14.06 162.9,72 arc90 158.9,76 130,76 arc90
  pour Bottom: 162.9,72 162.9,14.08 arc-90 158.9,10.08 130,10.08 arc-90 126,14.08 126,72 arc-90 130,76 158.9,76 arc-90
P5
  Top 1: JP1.P$6 97,83 83.82,69.82 P5.P$273
  Bottom 1: JP1.P$6 97,83 83.82,69.82 P5.P$272
  pour Top: 52,72 52,14 arc90 56,10 86,10 arc90 90,14 90,72 arc90 86,76 56,76 arc90
  pour Bottom: 86,10 56,10 arc-90 52,14 52,72 arc-90 56,76 86,76 arc-90 90,72 90,14 arc-90
P6
  Top 1: JP1.P$7 17.86,85 P6.P$353
  Bottom 1: JP1.P$7 17.02,85 P6.P$356
  pour Top: 3,171 15,171 arc-90 19,167 19,1 arc-90 15,-3 3,-3 arc-90 -1,1 -1,167 arc-90
  pour Bottom: -1,1 -1,167 arc-90 3,171 15,171 arc-90 19,167 19,1 arc-90 15,-3 3,-3 arc-90
P7
  Top 1: JP1.P$8 97,87 83.82,100.18 P7.P$210
  Bottom 1: JP1.P$8 97,87 83.82,100.18 P7.P$190
  pour Bottom: 53,98 53,158 arc-90 57,162 86,162 arc-90 90,158 90,98 arc-90 86,94 57,94 arc-90
  pour Top: 90,98 90,158 arc90 86,162 57,162 arc90 53,158 53,98 arc90 57,94 86,94 arc90
P8
  Top 1: JP1.P$9 169,89 157.66,100.34 P8.P$204
  Bottom 1: JP1.P$9 169,89 157.66,100.34 P8.P$209
  pour Top: 163,98 163,158 arc90 159,162 129.6,162 arc90 125.6,158 125.6,98 arc90 129.6,94 159,94 arc90
  pour Bottom: 129.6,162 159,162 arc-90 163,158 163,98 arc-90 159,94 129.6,94 arc-90 125.6,98 125.6,158 arc-90
P9
  Top 1: JP1.P$10 240,91 228.98,102.02 P9.P$191
  Bottom 1: JP1.P$10 240,91 228.98,102.02 P9.P$192
  pour Top: 236,98 236,158 arc90 232,162 203,162 arc90 199,158 199,98 arc90 203,94 232,94 arc90
  pour Bottom: 199,98 199,158 arc-90 203,162 232,162 arc-90 236,158 236,98 arc-90 232,94 203,94 arc-90
P10
  Top 1: JP1.P$11 310,93 301.98,101.02 P10.P$192
  Bottom 1: JP1.P$11 310,93 302.82,100.18 P10.P$190
  pour Top: 272,158 272,98 arc90 276,94 306,94 arc90 309,97 309,158 arc90 305,162 276,162 arc90
  pour Bottom: 306,94 276,94 arc-90 272,98 272,158 arc-90 276,162 305,162 arc-90 309,158 309,97 arc-90
P11
  Top 1: JP1.P$12 381,95 374,102 374,104.84 P11.P$188
  Bottom 1: JP1.P$12 381,95 374,102 374,104.84 P11.P$215
  pour Top: 382,98 382,158 arc90 378,162 349,162 arc90 345,158 345,98 arc90 349,94 378,94 arc90
  pour Bottom: 345,98 345,158 arc-90 349,162 378,162 arc-90 382,158 382,98 arc-90 378,94 349,94 arc-90
P12+
  Top 1: JP1.P$13 451.2,105.8 443.82,113.18 442.86,113.18
  Bottom 1: JP1.P$13 451.2,106.52 443.7,114.02
  pour Bottom (no thermals): 418,104 418,164 arc-90 422,168 430,168 arc-90 434,164 434,154 arc90 437,151 464,151 464,100 422,100 arc-90
  pour Top (no thermals): 463.96,151 437,151 arc-90 434,154 434,164 arc90 430,168 422,168 arc90 418,164 418,104 arc90 422,100 463.96,100

## Text on the board
tPlace: POSITIVE + | B0- 1 2 3 4 5 6 7 8 9 10 11 B12+ | FREESK8 CompactPCB 12S4P-21700 / v2.0 | NEGATIVE -
bPlace: B0- 1 2 3 4 5 6 7 8 9 10 11 B12+